# Altium schematic sheet OB_WRP.SchDoc
size A; DocumentNumber: 7; SheetNumber: 7; SheetTotal: 13
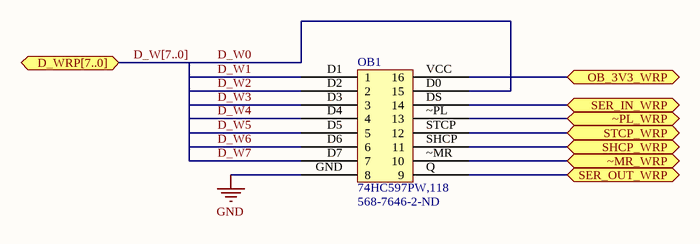
[diagram p0: OB_WRP.SchDoc]

## Parts
OB1  74HC597PW,118  Supplier Part Number 1: 568-7646-2-ND  [OB_TSSOP16]

## Ports
D_WRP[7..0], OB_3V3_WRP, SER_IN_WRP, SER_OUT_WRP, SHCP_WRP, STCP_WRP, ~MR_WRP, ~PL_WRP

## Nets
GND: OB1.GND(8)
D_W0: OB1.D0(15)
D_W1: OB1.D1(1)
D_W2: OB1.D2(2)
D_W3: OB1.D3(3)
D_W4: OB1.D4(4)
D_W5: OB1.D5(5)
D_W6: OB1.D6(6)
D_W7: OB1.D7(7)
OB_3V3_WRP: OB1.VCC(16) ; port OB_3V3_WRP
SER_IN_WRP: OB1.DS(14) ; port SER_IN_WRP
SER_OUT_WRP: OB1.Q(9) ; port SER_OUT_WRP
SHCP_WRP: OB1.SHCP(11) ; port SHCP_WRP
STCP_WRP: OB1.STCP(12) ; port STCP_WRP
~MR_WRP: OB1.~MR(10) ; port ~MR_WRP
~PL_WRP: OB1.~PL(13) ; port ~PL_WRP

## Buses and harness runs
bus D_W[7..0] = port D_WRP[7..0]

## Library data of the parts
OB1 = 74HC597PW,118: IC 8BIT SHIFT REGISTER 16TSSOP; Manufacturer: NXP Semiconductors; Output Type: Push-Pull; Number of Elements: 1; Number of Bits per Element: 8; Function: Parallel to Serial; Voltage - Supply: 2 V ~ 6 V; Supplier 1: Digi-Key; Manufacturer Part Number: 74HC597PW,118; RoHS: RoHS Compliant; Category: Integrated Circuits (ICs); Stock 1: 7500; Pricing 1: 2500=0.20506, 5000=0.19184, 12500=0.1786, 25000=0.16934, 62500=0.16538, 125000=0.15876 (USD); Packaging: Tape & Reel (TR); Logic Type: Shift Register; Operating Temperature: -40°C ~ 125°C; Mounting Type: Surface Mount; Package / Case: 16-TSSOP (0.173", 4.40mm Width); Supplier Device Package: 16-TSSOP; ComponentLink1URL: http://www.nxp.com/documents/data_sheet/74HC_HCT597.pdf; ComponentLink1Description: http://www.nxp.com/documents/data_sheet/74HC_HCT597.pdf